# Altium project ChristmasCal24_Candle.PrjPcb
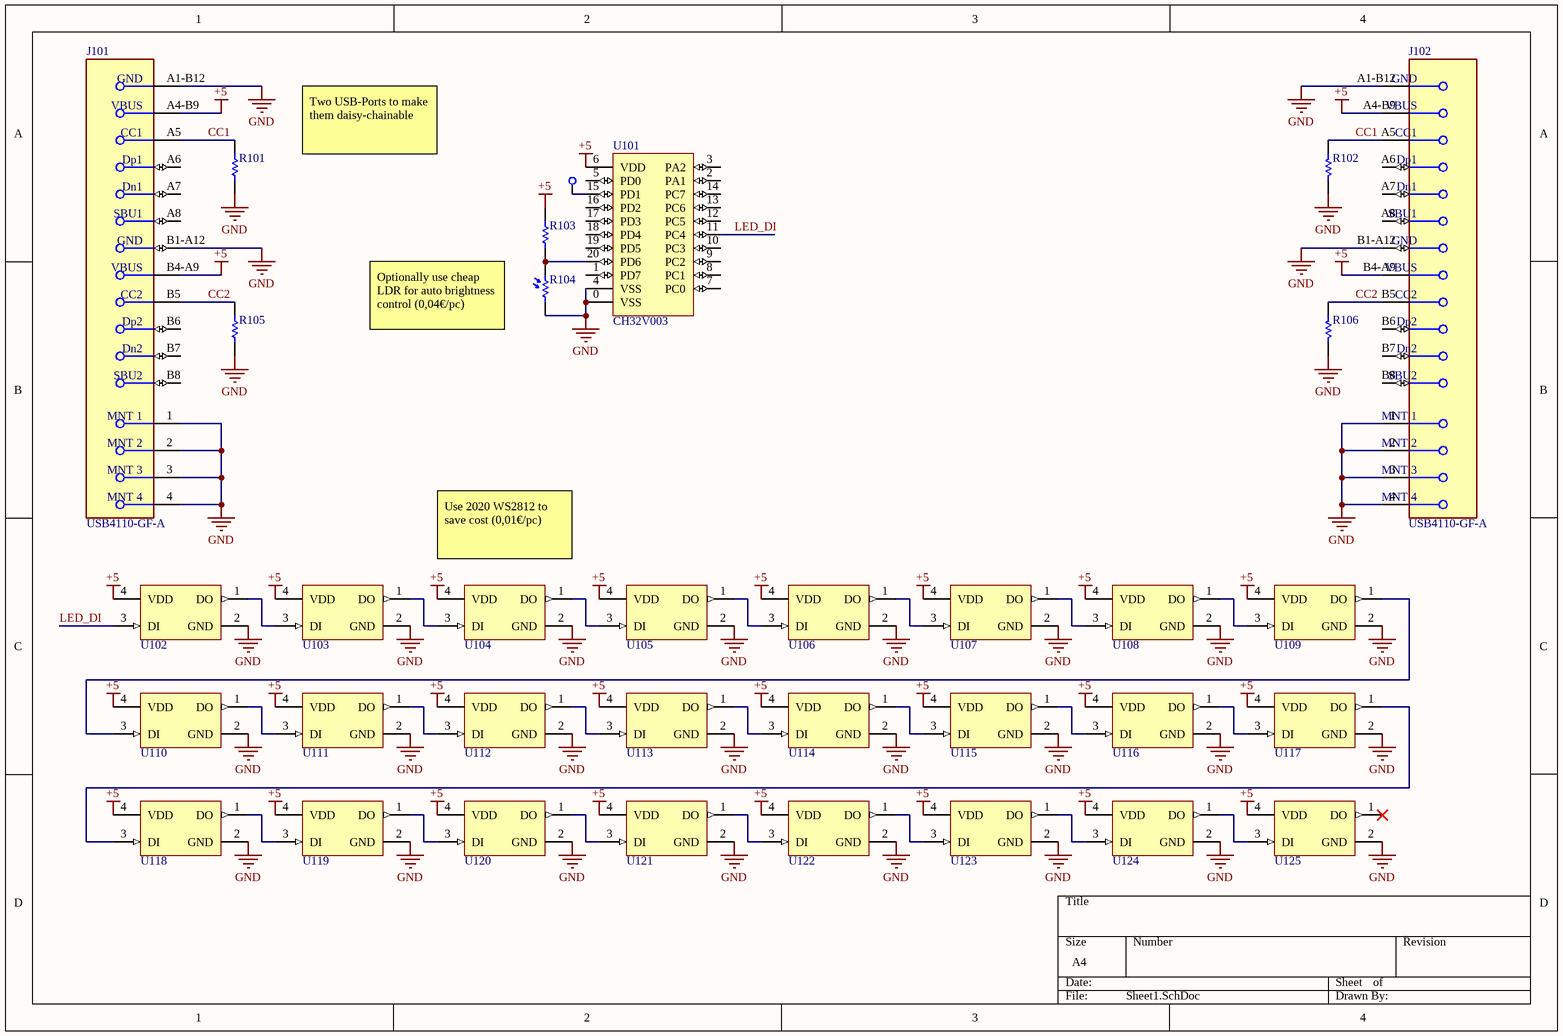
[diagram p0: Sheet1.SchDoc]
1 sheet, 34 parts. Net scope: global (net labels, ports and power ports of the same name join across sheets).
Board files: PCB1.PcbDoc, PCB2.PcbDoc

## Sheet Sheet1.SchDoc
size A4; SheetNumber: 1; SheetTotal: 1

### Parts
J101  USB4110-GF-A  [FP-USB4110-GF-A-MFG]
J102  USB4110-GF-A  [FP-USB4110-GF-A-MFG]
R101  Resistor  [RESC1608X06N]  (value not drawn)
R102  Resistor  [RESC1608X06N]  (value not drawn)
R103  Resistor  [RESC1608X06N]  (value not drawn)
R104  Photoconductive Resistor  [LDR_5016]  (value not drawn)
R105  Resistor  [RESC1608X06N]  (value not drawn)
R106  Resistor  [RESC1608X06N]  (value not drawn)
TP101  TestPoint  [TestPoint]  (value not drawn)
U101  CH32V003  [QFN40P300X300X75_HS-21N]
U102  NOT COMPATIBLE WITH WS2812B  [LED_WS2812-2020]  (value not drawn)
U103  NOT COMPATIBLE WITH WS2812B  [LED_WS2812-2020]  (value not drawn)
U104  NOT COMPATIBLE WITH WS2812B  [LED_WS2812-2020]  (value not drawn)
U105  NOT COMPATIBLE WITH WS2812B  [LED_WS2812-2020]  (value not drawn)
U106  NOT COMPATIBLE WITH WS2812B  [LED_WS2812-2020]  (value not drawn)
U107  NOT COMPATIBLE WITH WS2812B  [LED_WS2812-2020]  (value not drawn)
U108  NOT COMPATIBLE WITH WS2812B  [LED_WS2812-2020]  (value not drawn)
U109  NOT COMPATIBLE WITH WS2812B  [LED_WS2812-2020]  (value not drawn)
U110  NOT COMPATIBLE WITH WS2812B  [LED_WS2812-2020]  (value not drawn)
U111  NOT COMPATIBLE WITH WS2812B  [LED_WS2812-2020]  (value not drawn)
U112  NOT COMPATIBLE WITH WS2812B  [LED_WS2812-2020]  (value not drawn)
U113  NOT COMPATIBLE WITH WS2812B  [LED_WS2812-2020]  (value not drawn)
U114  NOT COMPATIBLE WITH WS2812B  [LED_WS2812-2020]  (value not drawn)
U115  NOT COMPATIBLE WITH WS2812B  [LED_WS2812-2020]  (value not drawn)
U116  NOT COMPATIBLE WITH WS2812B  [LED_WS2812-2020]  (value not drawn)
U117  NOT COMPATIBLE WITH WS2812B  [LED_WS2812-2020]  (value not drawn)
U118  NOT COMPATIBLE WITH WS2812B  [LED_WS2812-2020]  (value not drawn)
U119  NOT COMPATIBLE WITH WS2812B  [LED_WS2812-2020]  (value not drawn)
U120  NOT COMPATIBLE WITH WS2812B  [LED_WS2812-2020]  (value not drawn)
U121  NOT COMPATIBLE WITH WS2812B  [LED_WS2812-2020]  (value not drawn)
U122  NOT COMPATIBLE WITH WS2812B  [LED_WS2812-2020]  (value not drawn)
U123  NOT COMPATIBLE WITH WS2812B  [LED_WS2812-2020]  (value not drawn)
U124  NOT COMPATIBLE WITH WS2812B  [LED_WS2812-2020]  (value not drawn)
U125  NOT COMPATIBLE WITH WS2812B  [LED_WS2812-2020]  (value not drawn)

### Nets
+5: J101.A4-B9(VBUS) J101.B4-A9(VBUS) J102.A4-B9(VBUS) J102.B4-A9(VBUS) R103.2 U101.6(VDD) U102.4(VDD) U103.4(VDD) U104.4(VDD) U105.4(VDD) U106.4(VDD) U107.4(VDD) U108.4(VDD) U109.4(VDD) U110.4(VDD) U111.4(VDD) U112.4(VDD) U113.4(VDD) U114.4(VDD) U115.4(VDD) U116.4(VDD) U117.4(VDD) U118.4(VDD) U119.4(VDD) U120.4(VDD) U121.4(VDD) U122.4(VDD) U123.4(VDD) U124.4(VDD) U125.4(VDD)
GND: J101.1(MNT_1) J101.2(MNT_2) J101.3(MNT_3) J101.4(MNT_4) J101.A1-B12(GND) J101.B1-A12(GND) J102.1(MNT_1) J102.2(MNT_2) J102.3(MNT_3) J102.4(MNT_4) J102.A1-B12(GND) J102.B1-A12(GND) R101.1 R102.1 R104.1 R105.1 R106.1 U101.0(VSS) U101.4(VSS) U102.2(GND) U103.2(GND) U104.2(GND) U105.2(GND) U106.2(GND) U107.2(GND) U108.2(GND) U109.2(GND) U110.2(GND) U111.2(GND) U112.2(GND) U113.2(GND) U114.2(GND) U115.2(GND) U116.2(GND) U117.2(GND) U118.2(GND) U119.2(GND) U120.2(GND) U121.2(GND) U122.2(GND) U123.2(GND) U124.2(GND) U125.2(GND)
CC1: J101.A5(CC1) J102.A5(CC1) R101.2 R102.2
CC2: J101.B5(CC2) J102.B5(CC2) R105.2 R106.2
LED_DI: U101.11(PC4) U102.3(DI)
NetR103_1: R103.1 R104.2 U101.20(PD6)
NetTP101_TP: TP101.TP U101.15(PD1)
NetU102_1: U102.1(DO) U103.3(DI)
NetU103_1: U103.1(DO) U104.3(DI)
NetU104_1: U104.1(DO) U105.3(DI)
NetU105_1: U105.1(DO) U106.3(DI)
NetU106_1: U106.1(DO) U107.3(DI)
NetU107_1: U107.1(DO) U108.3(DI)
NetU108_1: U108.1(DO) U109.3(DI)
NetU109_1: U109.1(DO) U110.3(DI)
NetU110_1: U110.1(DO) U111.3(DI)
NetU111_1: U111.1(DO) U112.3(DI)
NetU112_1: U112.1(DO) U113.3(DI)
NetU113_1: U113.1(DO) U114.3(DI)
NetU114_1: U114.1(DO) U115.3(DI)
NetU115_1: U115.1(DO) U116.3(DI)
NetU116_1: U116.1(DO) U117.3(DI)
NetU117_1: U117.1(DO) U118.3(DI)
NetU118_1: U118.1(DO) U119.3(DI)
NetU119_1: U119.1(DO) U120.3(DI)
NetU120_1: U120.1(DO) U121.3(DI)
NetU121_1: U121.1(DO) U122.3(DI)
NetU122_1: U122.1(DO) U123.3(DI)
NetU123_1: U123.1(DO) U124.3(DI)
NetU124_1: U124.1(DO) U125.3(DI)

Not connected (* = marked no-connect by the designer): J101 A6(Dp1) A7(Dn1) A8(SBU1) B6(Dp2) B7(Dn2) B8(SBU2); J102 A6(Dp1) A7(Dn1) A8(SBU1) B6(Dp2) B7(Dn2) B8(SBU2); U101 1(PD7) 2(PA1) 3(PA2) 5(PD0) 7(PC0) 8(PC1) 9(PC2) 10(PC3) 12(PC5) 13(PC6) 14(PC7) 16(PD2) 17(PD3) 18(PD4) 19(PD5); U125 1(DO)*

### Notes on the sheet
- Two USB-Ports to make them daisy-chainable
- Optionally use cheap LDR for auto brightness control (0,04€/pc)
- (near U104) Use 2020 WS2812 to save cost (0,01€/pc)

### Library data of the parts
J101 J102 = CMP-245163-000002-1: CONN USB 2.0 TYPE-C R/A SMT; Manufacturer: GCT; Conn Orientation: Right Angle; Usb Standard: USB 2.0; Voltage Rating: 20V; Current Rating: 3/4.25/1.25/0.25A; Number Of Contacts: 16; Is Female: yes; Shielding: true; Standoff Height: 0.1mm; Octopart: https://octopart.com/usb4110-gf-a-gct-103941985; Temperature: -40°C to +85°C; RoHS: TRUE; Automotive: No; Contact Material: Gold,Nickel; Device Class L1: Connectors; Device Class L2: USB Connectors; Package: 0; Lead Free: Yes; ComponentLink2URL: https://gct.co/files/drawings/usb4110.pdf; Temperature Range High: +85°C; Temperature Range Low: -40°C; Height: 3.46mm; Manufacturer Part Number: USB4110-GF-A; ComponentLink2Description: Datasheet; Device Class L3: unset; Digikey Description: CONN USB 2.0 TYPE-C R/A SMT; Category: Conn
R101-R103 R105 R106 = R0603: Value: *
R104 = LDR: Value: *
U101 = CH32V003F4U6: CH32V003 series is an industrial-grade general-purpose microcontroller designed based on QingKe RISC-V2A / core, which supports 48MHz system main frequency in the product function
U102-U125 = WS2812_2018: Adressable RGB LED